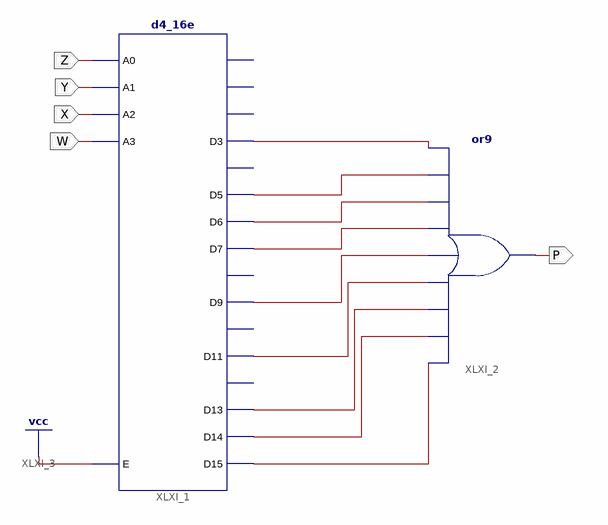
[diagram p0: schematic sheet 1]
// Xilinx ISE schematic Votecircuit3.sch (spartan3) as structural Verilog: 2 symbols, 5 ports
module Votecircuit3 (
  input  Z,
  input  Y,
  input  X,
  input  W,
  output P
);

  wire XLXN_1, XLXN_2, XLXN_3, XLXN_4, XLXN_6, XLXN_9, XLXN_10, XLXN_12, XLXN_13;

  d4_16e XLXI_1 (
    .A0(Z), .A1(Y), .A2(X), .A3(W), .E(1'b1), .D11(XLXN_9), .D13(XLXN_10), .D14(XLXN_12), .D15(XLXN_13),
    .D3(XLXN_1), .D5(XLXN_2), .D6(XLXN_3), .D7(XLXN_4), .D9(XLXN_6));  // open: D0, D1, D10, D12, D2, D4, D8
  or XLXI_2 (P, XLXN_13, XLXN_12, XLXN_10, XLXN_9, XLXN_6, XLXN_4, XLXN_3, XLXN_2, XLXN_1);
endmodule
